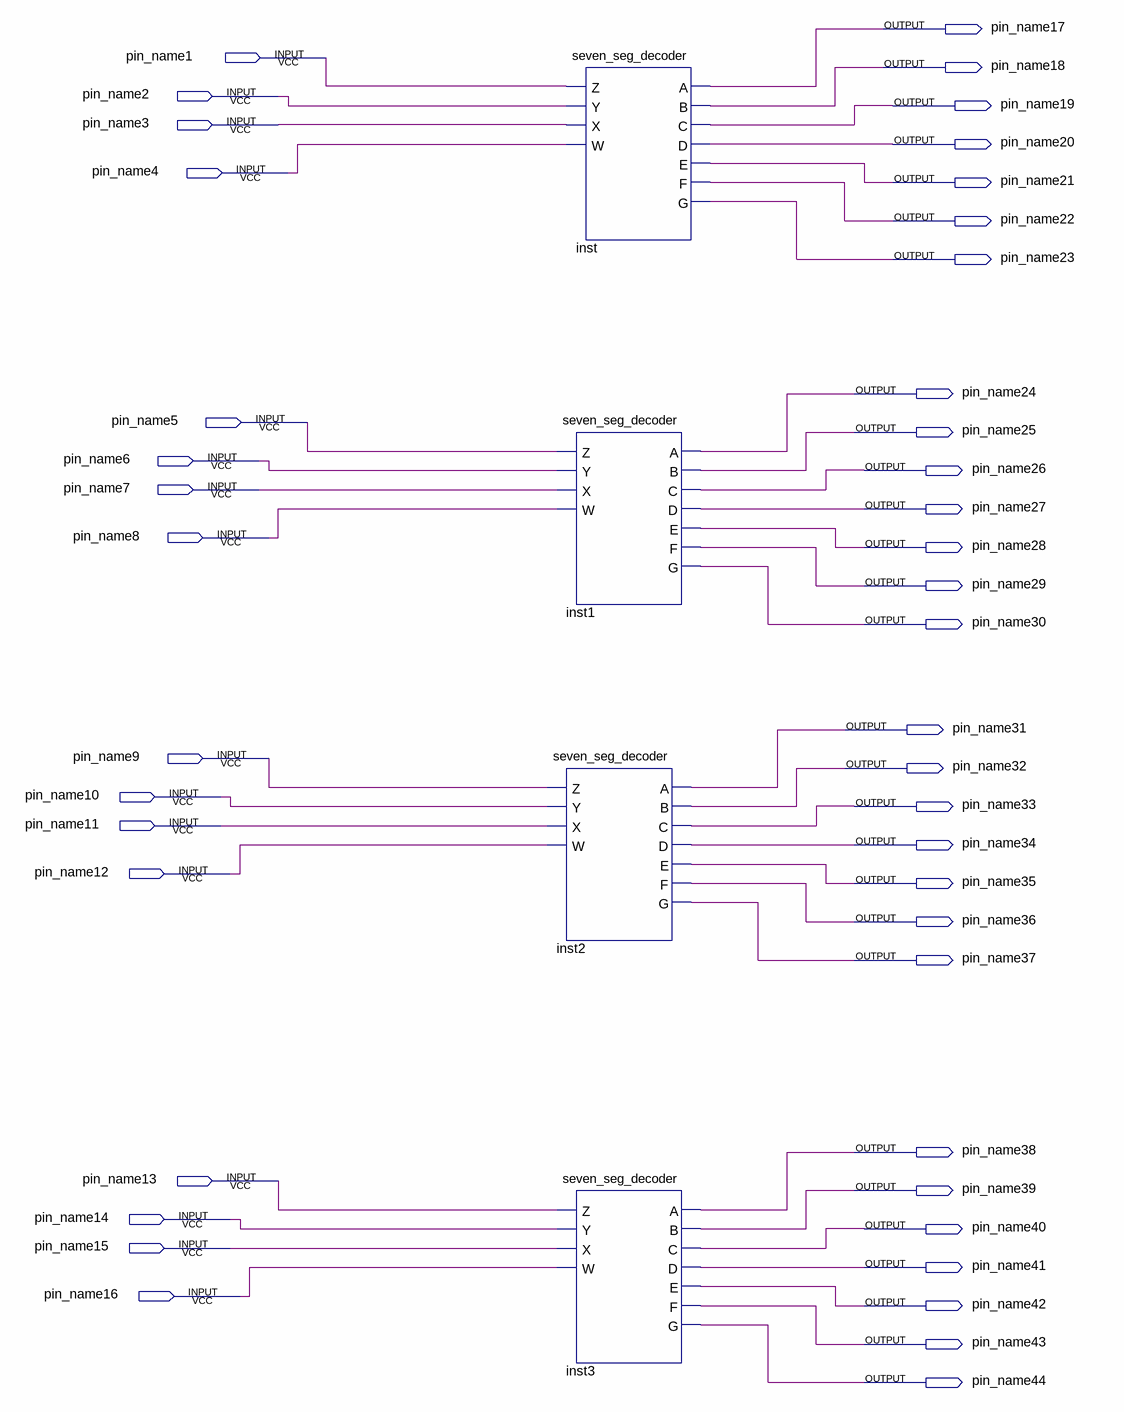
[diagram p0: schematic sheet]
// Quartus schematic lab5step1.bdf as structural Verilog: 4 symbols, 44 pins
module lab5step1 (
  input  pin_name1,
  input  pin_name2,
  input  pin_name3,
  input  pin_name4,
  input  pin_name5,
  input  pin_name6,
  input  pin_name7,
  input  pin_name8,
  input  pin_name9,
  input  pin_name10,
  input  pin_name11,
  input  pin_name12,
  input  pin_name13,
  input  pin_name14,
  input  pin_name15,
  input  pin_name16,
  output pin_name17,
  output pin_name18,
  output pin_name19,
  output pin_name20,
  output pin_name21,
  output pin_name22,
  output pin_name23,
  output pin_name24,
  output pin_name25,
  output pin_name26,
  output pin_name27,
  output pin_name28,
  output pin_name29,
  output pin_name30,
  output pin_name31,
  output pin_name32,
  output pin_name33,
  output pin_name34,
  output pin_name35,
  output pin_name36,
  output pin_name37,
  output pin_name38,
  output pin_name39,
  output pin_name40,
  output pin_name41,
  output pin_name42,
  output pin_name43,
  output pin_name44
);

  seven_seg_decoder inst (
    .Z(pin_name1), .Y(pin_name2), .X(pin_name3), .W(pin_name4), .A(pin_name17), .B(pin_name18),
    .C(pin_name19), .D(pin_name20), .E(pin_name21), .F(pin_name22), .G(pin_name23));
  seven_seg_decoder inst1 (
    .Z(pin_name5), .Y(pin_name6), .X(pin_name7), .W(pin_name8), .A(pin_name24), .B(pin_name25),
    .C(pin_name26), .D(pin_name27), .E(pin_name28), .F(pin_name29), .G(pin_name30));
  seven_seg_decoder inst2 (
    .Z(pin_name9), .Y(pin_name10), .X(pin_name11), .W(pin_name12), .A(pin_name31), .B(pin_name32),
    .C(pin_name33), .D(pin_name34), .E(pin_name35), .F(pin_name36), .G(pin_name37));
  seven_seg_decoder inst3 (
    .Z(pin_name13), .Y(pin_name14), .X(pin_name15), .W(pin_name16), .A(pin_name38), .B(pin_name39),
    .C(pin_name40), .D(pin_name41), .E(pin_name42), .F(pin_name43), .G(pin_name44));
endmodule
